# Altium schematic sheet lab4_microprocessor.SchDoc
size A4; Author: Michał Wojna; CompanyName: AGH; Revision: 1; SheetNumber: 3; SheetTotal: 3
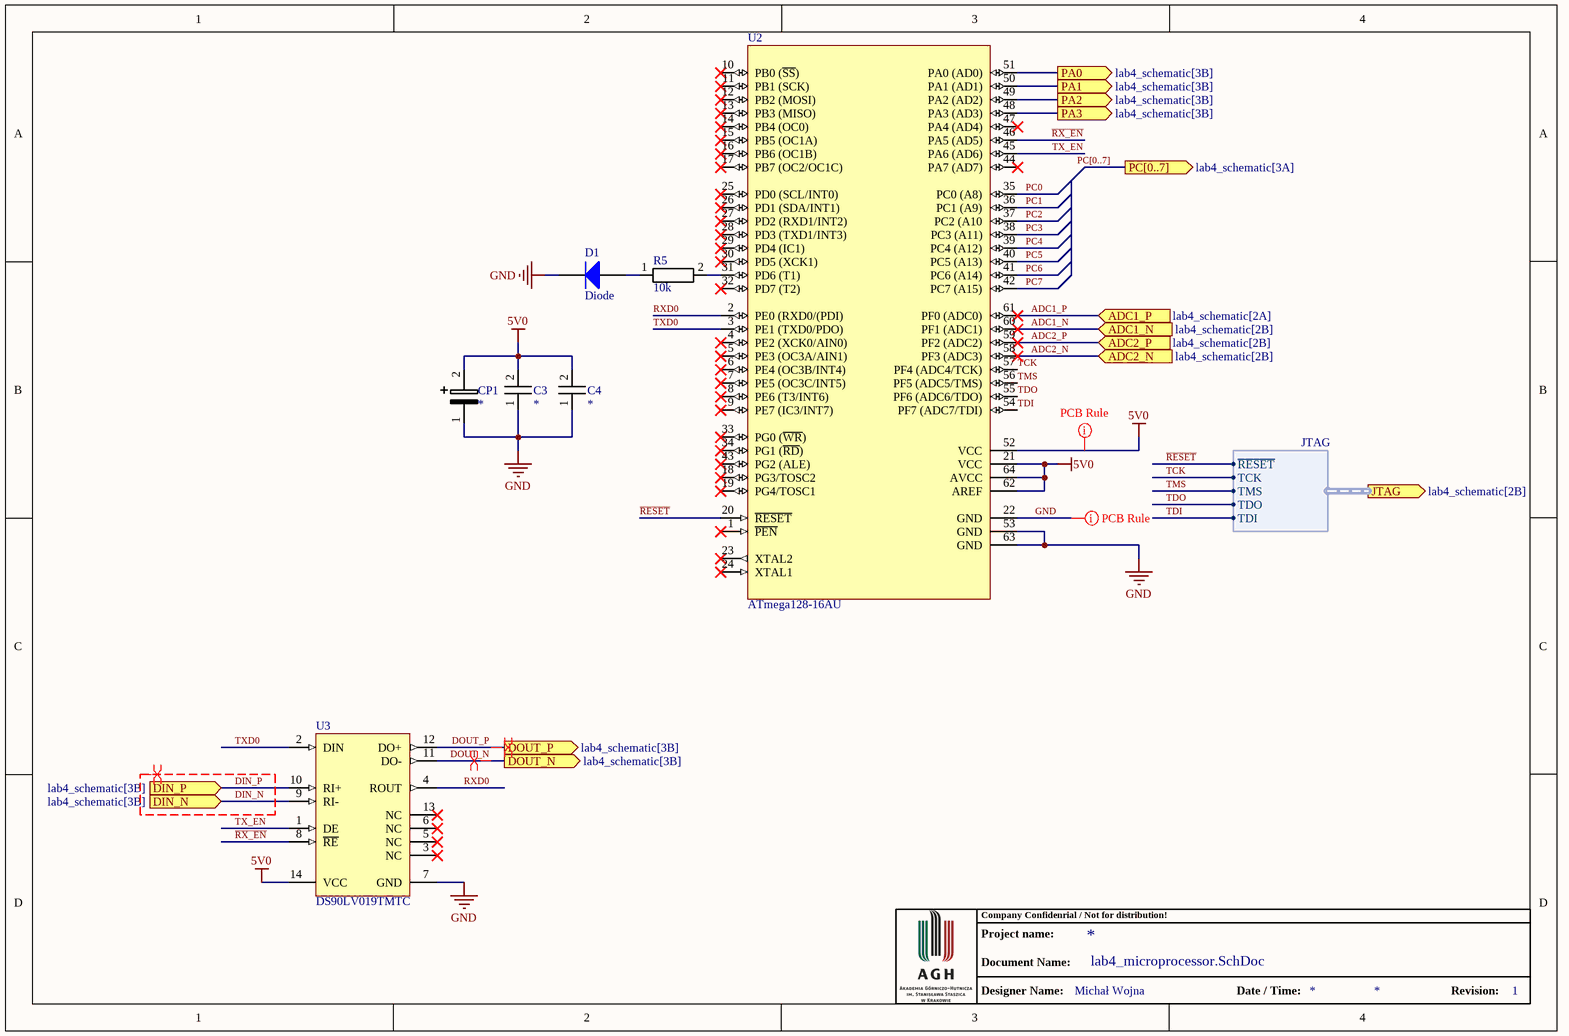
[diagram p0: lab4_microprocessor.SchDoc]

## Parts
C3  *  [0805_STD]
C4  *  [0805_STD]
CP1  *  [VJ_Tantalum_D]
D1  Diode  [SMC]
R5  10k  [0603]
U2  ATmega128-16AU  [64A_M]
U3  DS90LV019TMTC  [PW0014A_L]

## Ports
ADC1_N (in, see lab4_schematic[2B]), ADC1_P (in, see lab4_schematic[2A]), ADC2_N (in, see lab4_schematic[2B]), ADC2_P (in, see lab4_schematic[2B]), DIN_N (in, see lab4_schematic[3B]), DIN_P (in, see lab4_schematic[3B]), DOUT_N (out, see lab4_schematic[3B]), DOUT_P (out, see lab4_schematic[3B]), JTAG (out, harness JTAG, see lab4_schematic[2B]), PA0 (out, see lab4_schematic[3B]), PA1 (out, see lab4_schematic[3B]), PA2 (out, see lab4_schematic[3B]), PA3 (out, see lab4_schematic[3B]), PC[0..7] (out, see lab4_schematic[3A])

## Harnesses
JTAG: ~{RESET}, TCK, TMS, TDO, TDI

## Nets
5V0: C3.2(PIN) C4.2(PIN) CP1.2(PIN) U2.21(VCC) U2.52(VCC) U2.62(AREF) U2.64(AVCC) U3.14(VCC)
GND: C3.1(PIN) C4.1(PIN) CP1.1(PIN) D1.2(K) U2.22(GND) U2.53(GND) U2.63(GND) U3.7(GND)
~{RESET}: U2.20(~{RESET}) ; port JTAG.~{RESET}
ADC1_N: U2.60(PF1_(ADC1)) ; port ADC1_N
ADC1_P: U2.61(PF0_(ADC0)) ; port ADC1_P
ADC2_N: U2.58(PF3_(ADC3)) ; port ADC2_N
ADC2_P: U2.59(PF2_(ADC2)) ; port ADC2_P
DIN_N: U3.9(RI-) ; port DIN_N
DIN_P: U3.10(RI+) ; port DIN_P
DOUT_N: U3.11(DO-) ; port DOUT_N
DOUT_P: U3.12(DO+) ; port DOUT_P
PA0: U2.51(PA0_(AD0)) ; port PA0
PA1: U2.50(PA1_(AD1)) ; port PA1
PA2: U2.49(PA2_(AD2)) ; port PA2
PA3: U2.48(PA3_(AD3)) ; port PA3
PC0: U2.35(PC0_(A8))
PC1: U2.36(PC1_(A9))
PC2: U2.37(PC2_(A10)
PC3: U2.38(PC3_(A11))
PC4: U2.39(PC4_(A12))
PC5: U2.40(PC5_(A13))
PC6: U2.41(PC6_(A14))
PC7: U2.42(PC7_(A15))
~{RX_EN}: U2.46(PA5_(AD5)) U3.8(~{RE})
RXD0: U2.2(PE0_(RXD0/(PDI)) U3.4(ROUT)
TCK: U2.57(PF4_(ADC4/TCK)) ; port JTAG.TCK
TDI: U2.54(PF7_(ADC7/TDI)) ; port JTAG.TDI
TDO: U2.55(PF6_(ADC6/TDO)) ; port JTAG.TDO
TMS: U2.56(PF5_(ADC5/TMS)) ; port JTAG.TMS
TX_EN: U2.45(PA6_(AD6)) U3.1(DE)
TXD0: U2.3(PE1_(TXD0/PDO)) U3.2(DIN)
NetD1_1: D1.1(A) R5.1(PIN)
NetR5_2: R5.2(PIN) U2.31(PD6_(T1))

Not connected (* = marked no-connect by the designer): U2 1(~{PEN})* 4(PE2_(XCK0/AIN0))* 5(PE3_(OC3A/AIN1))* 6(PE4_(OC3B/INT4))* 7(PE5_(OC3C/INT5))* 8(PE6_(T3/INT6))* 9(PE7_(IC3/INT7))* 10(PB0_(~{SS}))* 11(PB1_(SCK))* 12(PB2_(MOSI))* 13(PB3_(MISO))* 14(PB4_(OC0))* 15(PB5_(OC1A))* 16(PB6_(OC1B))* 17(PB7_(OC2/OC1C))* 18(PG3/TOSC2)* 19(PG4/TOSC1)* 23(XTAL2)* 24(XTAL1)* 25(PD0_(SCL/INT0))* 26(PD1_(SDA/INT1))* 27(PD2_(RXD1/INT2))* 28(PD3_(TXD1/INT3))* 29(PD4_(IC1))* 30(PD5_(XCK1))* 32(PD7_(T2))* 33(PG0_(~{WR}))* 34(PG1_(~{RD}))* 43(PG2_(ALE))* 44(PA7_(AD7))* 47(PA4_(AD4))*; U3 3(NC)* 5(NC)* 6(NC)* 13(NC)*

## Buses and harness runs
bus PC[0..7] = port PC[0..7]

## Layout directives
rule Width Constraint [Pref Width = 20mil    Min Width = 15mil    Max Width = 50mil]: 5V0, GND
differential pair: DIN_N, DIN_P, DOUT_N, DOUT_P

## Notes on the sheet
- Company Confidenrial / Not for distribution!
- Project name:
- Document Name:
- Designer Name:
- Date / Time:
- Revision:

## Library data of the parts
C3 C4 = Capacitor: Manufacturer: *; Part Number: *; Value: *
CP1 = Capacitor_polarized: Manufacturer: *; Part Number: *; Value: *
D1 = Diode: Default Diode; Published: 8-Jun-2000; LatestRevisionDate: 17-Jul-2002; LatestRevisionNote: Re-released for DXP Platform.; PackageVersion: Sep-1996; PackageReference: SMC; Publisher: Altium Limited; PackageDescription: DO-214-AB/SMC; 2 C-Bend Leads; Body 7.9 x 5.9 mm, inc. leads (LxW); Code_JEDEC: DO-214-AB
R5 = Resistor: Manufacturer: *; Part Number: *; Value: 10k
U2 = CMP-0095-00259-2: 8-bit AVR Microcontroller, 4.5-5.5V, 128KB Flash, 4KB EEPROM, 4KB SRAM, 64-pin TQFP, Industrial Grade (-40°C to 85°C); ComponentLink3URL: http://www.atmel.com/dyn/resources/prod_documents/2467S.pdf; PackageVersion: revC, Oct-2010; ComponentLink2URL: http://www.atmel.com/dyn/resources/prod_documents/doc2467.pdf; ComponentLink2Description: ATmega128(L) Datasheet; ComponentLink1Description: Manufacturer URL; PackageReference: 64A; DatasheetVersion: revX, Jun-2011; ComponentLink3Description: ATmega128(L) Summary; ComponentLink1URL: http://www.atmel.com/; RevisionNote: PackageVersion updated. URLs added.; Code_JEDEC: MS-026-AEB; PackageDescription: 64-Pin Plastic Thin Profile Quad Flat Pack, 14 x 14 x 1.0 mm Body, 0.8 mm Pitch (TQFP)
U3 = CMP-0058-01150-3: 3.3V or 5V LVDS Driver/Receiver, 14-pin TSSOP; Manufacturer: Texas Instruments; PackageTopMarking: NSZXYTT*LV019T*MTC; PowerWise: N; CompType: Interface IC; ComponentLink1URL: http://www.ti.com/general/docs/lit/getliterature.tsp?genericPartNumber=DS90LV019&fileType=pdf; PackageReference: PW0014A; RoHS: N; ComponentLink1Description: Datasheet URL; PackageDescription: Molded TSSOP, JEDEC, 5 x 4.4 x 0.9mm Body, 14 Lead, 0.65mm Pitch; Code_JEDEC: MO-153-AB-1; PinCount: 14